# EAGLE schematic MBO (EAGLE 7.4.0)
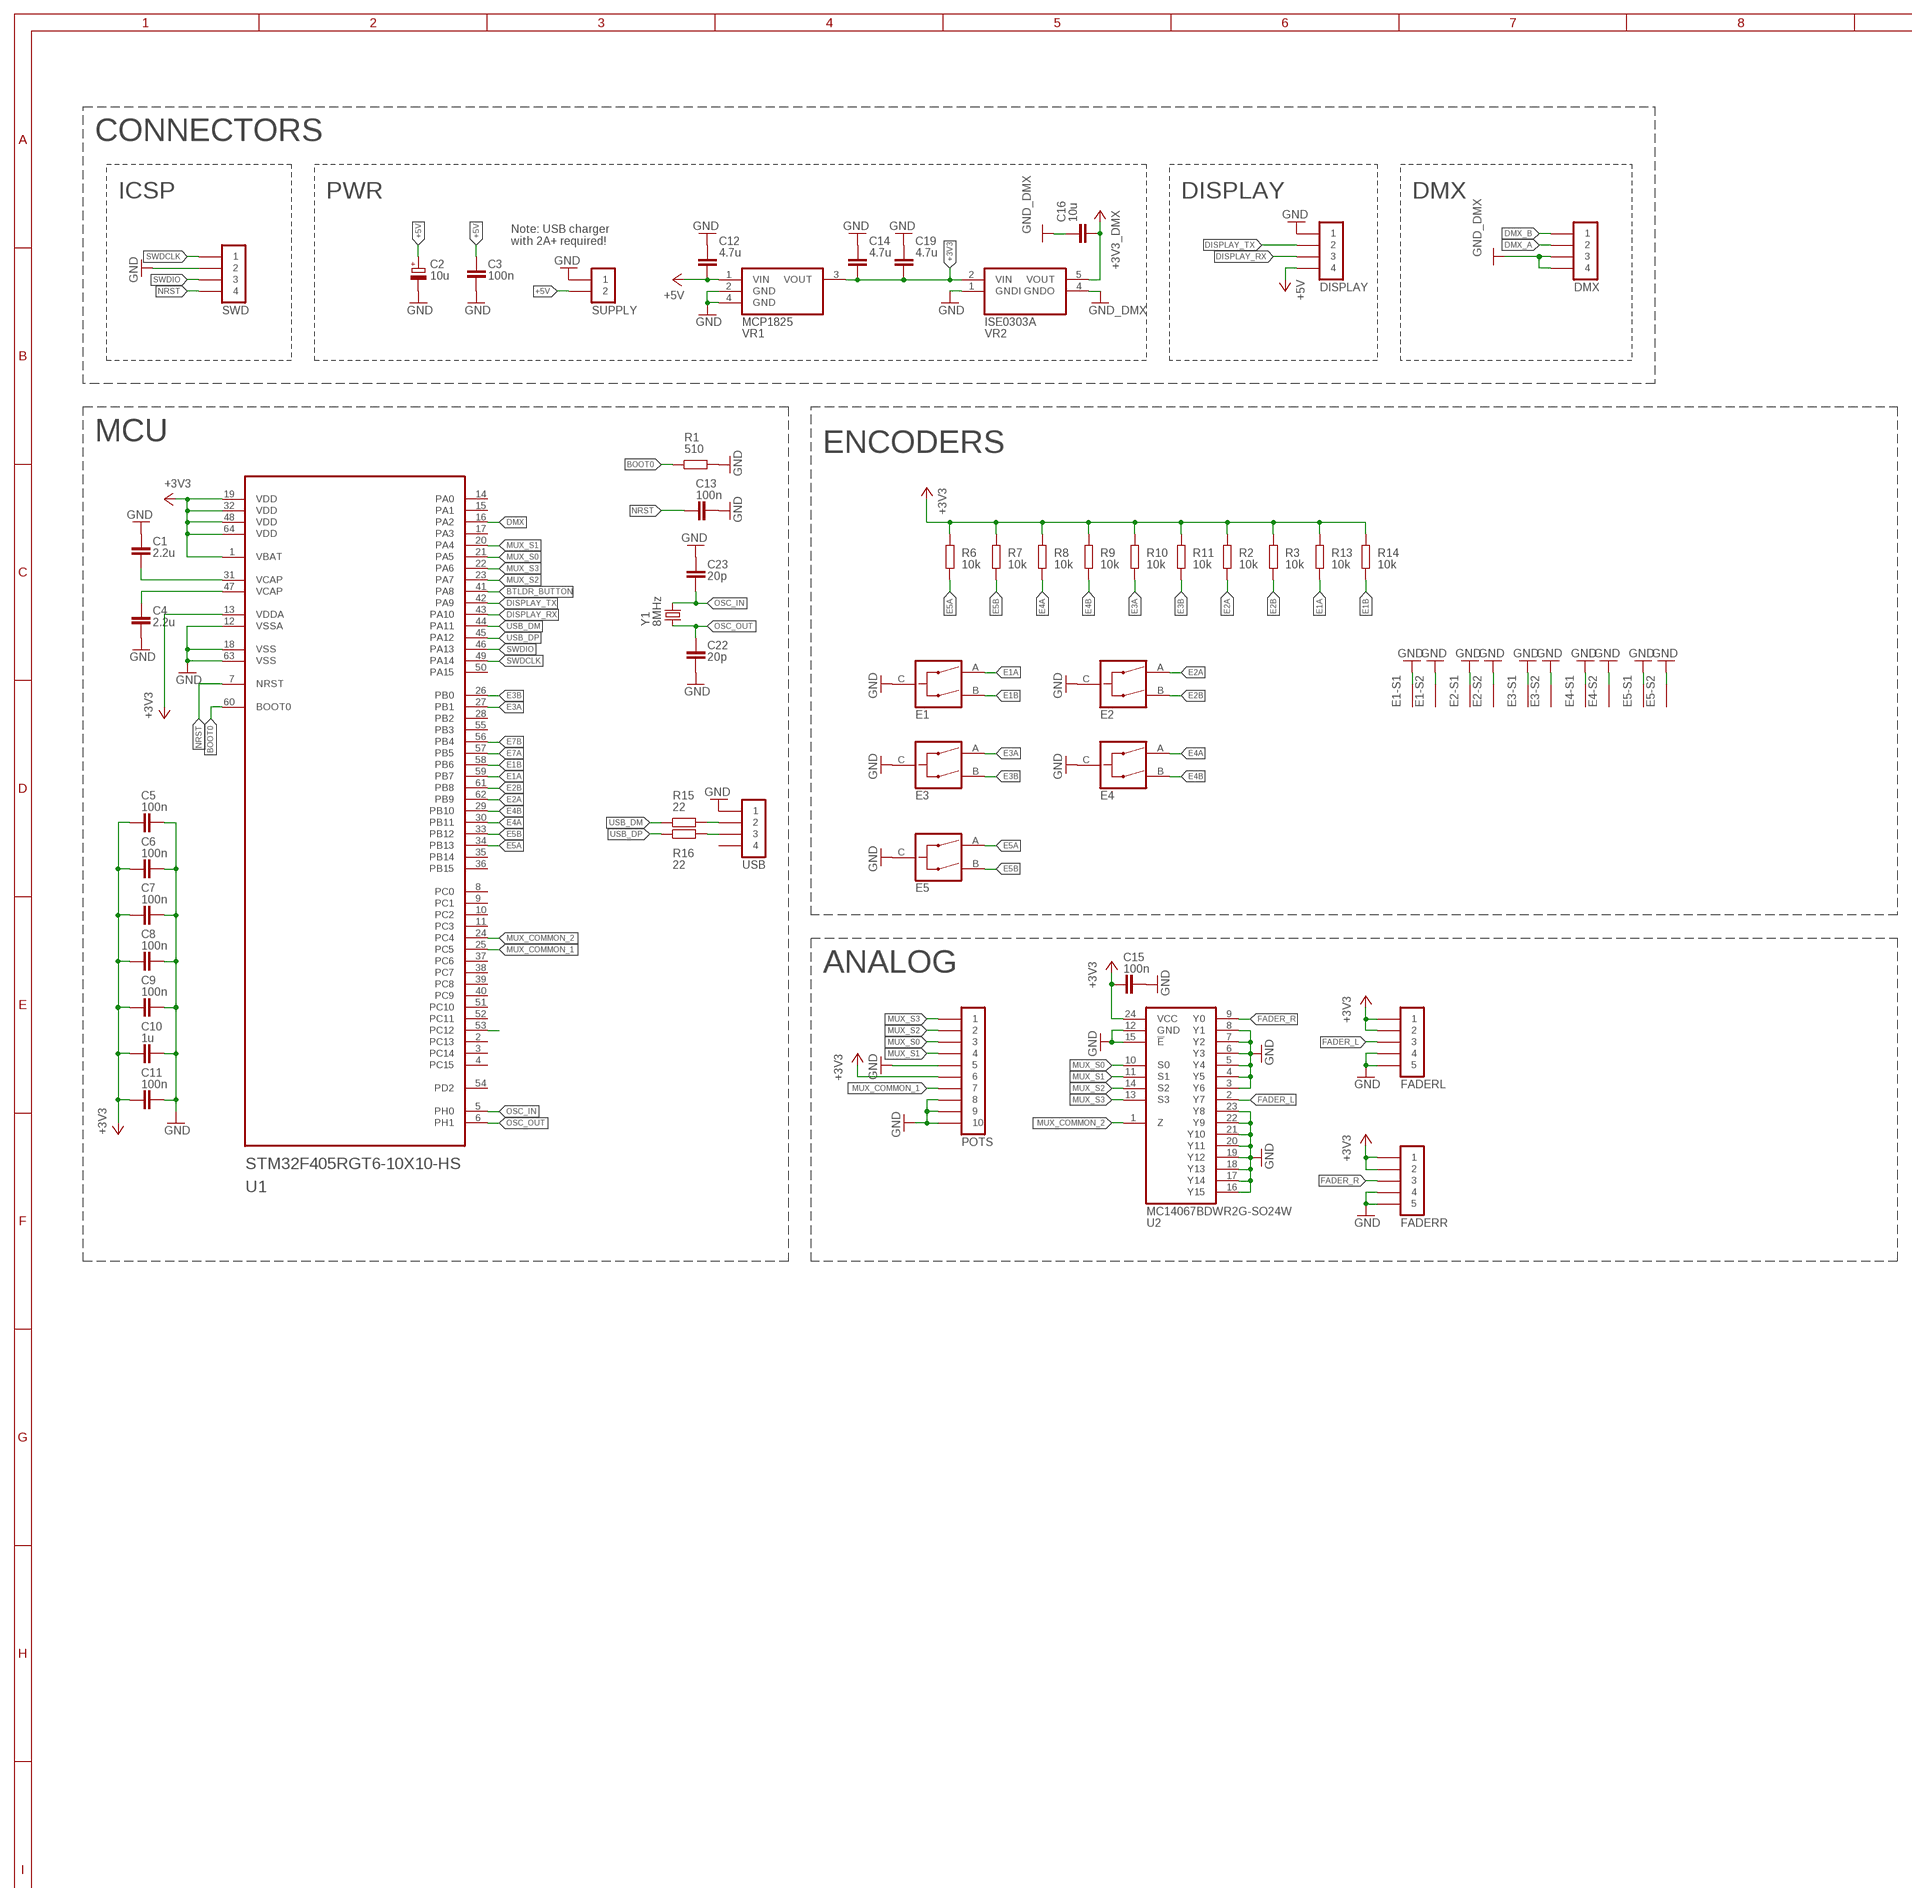
[diagram p0: schematic, sheet 1, part 1 of 2]
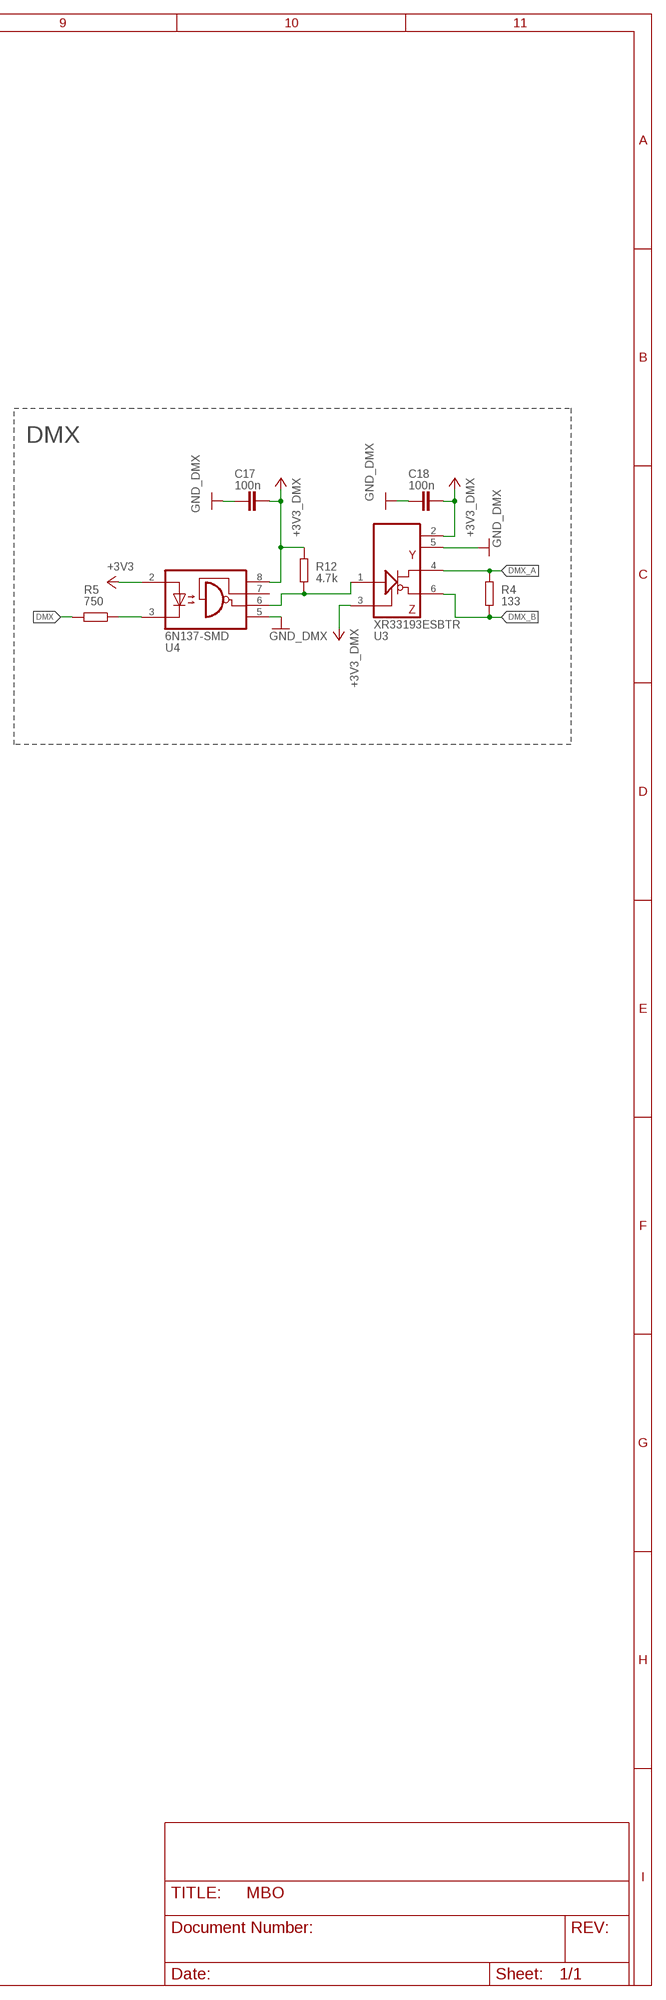
[diagram p1: schematic, sheet 1, part 2 of 2]

## Parts
C1  2.2u  CAPACITOR-0805  [C0805]
C2  10u  ELECTROLYTIC_CAPACITOR-C-TH-E-0401  [C-TH-E-0401]
C3  100n  CAPACITOR-0805  [C0805]
C4  2.2u  CAPACITOR-0805  [C0805]
C5  100n  CAPACITOR-0805  [C0805]
C6  100n  CAPACITOR-0805  [C0805]
C7  100n  CAPACITOR-0805  [C0805]
C8  100n  CAPACITOR-0805  [C0805]
C9  100n  CAPACITOR-0805  [C0805]
C10  1u  CAPACITOR-0805  [C0805]
C11  100n  CAPACITOR-0805  [C0805]
C12  4.7u  CAPACITOR-0805  [C0805]
C13  100n  CAPACITOR-0805  [C0805]
C14  4.7u  CAPACITOR-0805  [C0805]
C15  100n  CAPACITOR-0805  [C0805]
C16  10u  CAPACITOR-0805  [C0805]
C17  100n  CAPACITOR-0805  [C0805]
C18  100n  CAPACITOR-0805  [C0805]
C19  4.7u  CAPACITOR-0805  [C0805]
C22  20p  CAPACITOR-0805  [C0805]
C23  20p  CAPACITOR-0805  [C0805]
DISPLAY  PINHD-1X04-JST-XH-H  [JST-XH-04P-H]
DMX  PINHD-1X04-JST-XH-H  [JST-XH-04P-H]
E1  ALPS-EC12E24404AX  [EC12E-1]
E2  ALPS-EC12E24404AX  [EC12E-1]
E3  ALPS-EC12E24404AX  [EC12E-1]
E4  ALPS-EC12E24404AX  [EC12E-1]
E5  ALPS-EC12E24404AX  [EC12E-1]
FADERL  PINHD-1X05-FFC-1MM-Z  [MOLEX-52271-0579]
FADERR  PINHD-1X05-FFC-1MM-Z  [MOLEX-52271-0579]
POTS  PINHD-1X10-FFC-1MM-Z  [MOLEX-52271-1079]
R1  510  RESISTOR-0805  [R0805]
R2  10k  RESISTOR-0805  [R0805]
R3  10k  RESISTOR-0805  [R0805]
R4  133  RESISTOR-0805  [R0805]
R5  750  RESISTOR-0805  [R0805]
R6  10k  RESISTOR-0805  [R0805]
R7  10k  RESISTOR-0805  [R0805]
R8  10k  RESISTOR-0805  [R0805]
R9  10k  RESISTOR-0805  [R0805]
R10  10k  RESISTOR-0805  [R0805]
R11  10k  RESISTOR-0805  [R0805]
R12  4.7k  RESISTOR-0805  [R0805]
R13  10k  RESISTOR-0805  [R0805]
R14  10k  RESISTOR-0805  [R0805]
R15  22  RESISTOR-0805  [R0805]
R16  22  RESISTOR-0805  [R0805]
SUPPLY  PINHD-1X02-JST-XH-H  [JST-XH-02P-H]
SWD  PINHD-1X04-TH-2.54MM  [1X04-2.54]
U1  STM32F405RGT6-10X10-HS  [TQFP-64-10X10-HS]
U2  MC14067BDWR2G-SO24W  [SO24-W]
U3  XR33193ESBTR  [TSOT23-6]
U4  6N137-SMD  [SMD-8]
USB  PINHD-1X04-JST-XH-H  [JST-XH-04P-H]
VR1  MCP1825  [SOT223]
VR2  ISE0303A  [SMD-8-5]
Y1  8MHz  CRYSTAL-HC49  [HC49US]

## Nets
+3V3: C5.1 C6.1 C7.1 C8.1 C9.1 C10.1 C11.1 C14.1 C15.1 C19.1 FADERL.1 FADERL.2 FADERR.1 FADERR.2 POTS.6 R2.2 R3.2 R6.2 R7.2 R8.2 R9.2 R10.2 R11.2 R13.2 R14.2 U1.1(VBAT) U1.13(VDDA) U1.19(VDD) U1.32(VDD) U1.48(VDD) U1.64(VDD) U2.24(VCC) U4.2(A) VR1.3(VOUT) VR2.2(VIN)
+3V3_DMX: C16.1 C17.2 C18.2 R12.2 U3.2(VCC) U3.3(DE) U4.8(VCC) VR2.5(VOUT)
+5V: C2.+ C3.1 C12.1 DISPLAY.4 SUPPLY.2 VR1.1(VIN)
BOOT0: R1.1 U1.60(BOOT0)
BTLDR_BUTTON: U1.41(PA8)
DISPLAY_RX: DISPLAY.3 U1.43(PA10)
DISPLAY_TX: DISPLAY.2 U1.42(PA9)
DMX: R5.2 U1.16(PA2)
DMX_A: DMX.2 R4.2 U3.4(B)
DMX_B: DMX.1 R4.1 U3.6(A)
E1A: E1.A R13.1 U1.59(PB7)
E1B: E1.B R14.1 U1.58(PB6)
E2A: E2.A R2.1 U1.62(PB9)
E2B: E2.B R3.1 U1.61(PB8)
E3A: E3.A R10.1 U1.27(PB1)
E3B: E3.B R11.1 U1.26(PB0)
E4A: E4.A R8.1 U1.30(PB11)
E4B: E4.B R9.1 U1.29(PB10)
E5A: E5.A R6.1 U1.34(PB13)
E5B: E5.B R7.1 U1.33(PB12)
E7A: U1.57(PB5)
E7B: U1.56(PB4)
FADER_L: FADERL.3 U2.2(Y7)
FADER_R: FADERR.3 U2.9(Y0)
GND: C1.1 C2.- C3.2 C4.2 C5.2 C6.2 C7.2 C8.2 C9.2 C10.2 C11.2 C12.2 C13.2 C14.2 C15.2 C19.2 C22.2 C23.1 DISPLAY.1 E1.C E1.S1(S) E1.S2(S) E2.C E2.S1(S) E2.S2(S) E3.C E3.S1(S) E3.S2(S) E4.C E4.S1(S) E4.S2(S) E5.C E5.S1(S) E5.S2(S) FADERL.4 FADERL.5 FADERR.4 FADERR.5 POTS.5 POTS.8 POTS.9 POTS.10 R1.2 SUPPLY.1 SWD.2 U1.12(VSSA) U1.18(VSS) U1.63(VSS) U2.3(Y6) U2.4(Y5) U2.5(Y4) U2.6(Y3) U2.7(Y2) U2.8(Y1) U2.12(GND) U2.15(!E) U2.16(Y15) U2.17(Y14) U2.18(Y13) U2.19(Y12) U2.20(Y11) U2.21(Y10) U2.22(Y9) U2.23(Y8) USB.1 VR1.2(GND) VR1.4(GND) VR2.1(GNDI)
GND_DMX: C16.2 C17.1 C18.1 DMX.3 DMX.4 U3.5(GND) U4.5(GND) VR2.4(GNDO)
MUX_COMMON_1: POTS.7 U1.25(PC5)
MUX_COMMON_2: U1.24(PC4) U2.1(Z)
MUX_S0: POTS.3 U1.21(PA5) U2.10(S0)
MUX_S1: POTS.4 U1.20(PA4) U2.11(S1)
MUX_S2: POTS.2 U1.23(PA7) U2.14(S2)
MUX_S3: POTS.1 U1.22(PA6) U2.13(S3)
N$1: U1.53(PC12)
N$2: C1.2 U1.31(VCAP)
N$3: C4.1 U1.47(VCAP)
N$4: R5.1 U4.3(C)
N$5: R12.1 U3.1(DI) U4.6(VO)
NRST: C13.1 SWD.4 U1.7(NRST)
OSC_IN: C23.2 U1.5(PH0) Y1.2
OSC_OUT: C22.1 U1.6(PH1) Y1.1
SWDCLK: SWD.1 U1.49(PA14)
SWDIO: SWD.3 U1.46(PA13)
USB_DM: R15.1 U1.44(PA11)
USB_DM_ESD: R15.2 USB.2
USB_DP: R16.1 U1.45(PA12)
USB_DP_ESD: R16.2 USB.3
Unconnected: U1.2(PC13) U1.3(PC14) U1.4(PC15) U1.8(PC0) U1.9(PC1) U1.10(PC2) U1.11(PC3) U1.14(PA0) U1.15(PA1) U1.17(PA3) U1.28(PB2) U1.35(PB14) U1.36(PB15) U1.37(PC6) U1.38(PC7) U1.39(PC8) U1.40(PC9) U1.50(PA15) U1.51(PC10) U1.52(PC11) U1.54(PD2) U1.55(PB3) U4.7(VE) USB.4

## Notes on the sheet
- CONNECTORS
- ICSP | PWR | DISPLAY | DMX
- Note: USB charger
  with 2A+ required!
- MCU | DMX
- ENCODERS
- ANALOG

## Library data of the parts
C1 C3-C19 C22 C23 = igor_lbr:CAPACITOR: Capacitor
C2 = igor_lbr:ELECTROLYTIC_CAPACITOR: Electrolytic capacitor
DISPLAY DMX SWD USB = igor_lbr:PINHD-1X04
E1-E5 = igor_lbr:ALPS-EC12E24404AX: ALPS encoder; MANUFACTURER: ALPS; MPN: EC12E24404A8
FADERL FADERR = igor_lbr:PINHD-1X05: Pin Header; MANUFACTURER: Molex; MPN: 52271-0579
POTS = igor_lbr:PINHD-1X10: Pin header; MANUFACTURER: Molex; MPN: 52271-1079
R1-R16 = igor_lbr:RESISTOR: Resistor
SUPPLY = igor_lbr:PINHD-1X02: Pin Header
U1 = igor_lbr:STM32F405RGT6: ARM Cortex-M4 32b MCU+FPU; MANUFACTURER: ST Microelectronics; MPN: STM32F405RGT6
U2 = igor_lbr:MC14067BDWR2G: 16-Channel Analog Multiplexer/Demultiplexer; MANUFACTURER: ON Semiconductor; MPN: MC14067BDWR2G
U3 = igor_lbr:XR33193ESBTR: RS-485 driver; MANUFACTURER: MaxLinear; MPN: XR33193ESBTR
U4 = igor_lbr:6N137: High Speed Optocoupler; MANUFACTURER: Lite-On; MPN: 6N137S
VR1 = igor_lbr:MCP1825: 500 mA, Low Voltage, Low Quiescent Current LDO Regulator; MANUFACTURER: Microchip; MPN: MCP1825S-3302E/DB
VR2 = igor_lbr:ISE0303A: DC-DC Converter
Y1 = igor_lbr:CRYSTAL: Crystal; MANUFACTURER: TXC; MPN: 9B-16.000MEEJ-B

## Net classes
0 default: width 0.203 mm
1 vcc: width 0.254 mm